# EAGLE design regulator (EAGLE 9.6.2)
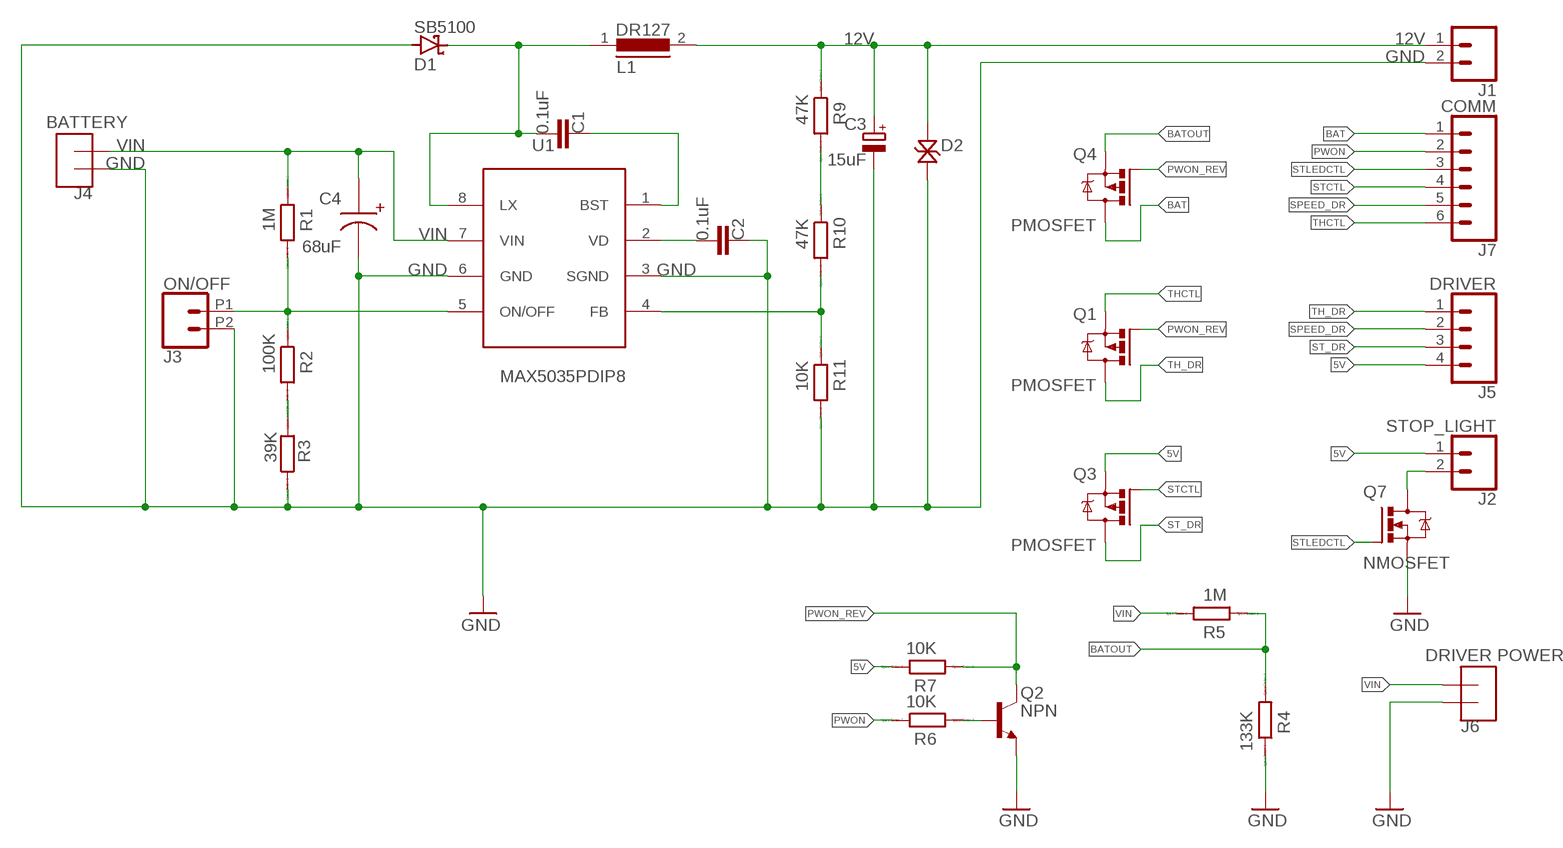
[diagram p0: schematic, sheet 1]

## Parts
C1  0.1uF  C_CHIP-1206(3216-METRIC)  [CAPC3216X135]
C2  0.1uF  C_CHIP-1206(3216-METRIC)  [CAPC3216X135]
C3  15uF  C-POL_TANTALUM-2917(7343-METRIC)  [CAPMP7343X310N]
C4  68uF  CPANASONIC_H13  [CAPAE1230X1250N]
D1  SB5100  MBR360G  [DO201AD]
D2  P4SMAJ12CA  TVS_DIODESMA  [DIOM5027X220N]
J1  CONN_02PTH3  [1X02_LONGPADS]
J2  STOP_LIGHT  CONN_02  [1X02]
J3  ON/OFF  CONN_022.54MM_SCREWTERM  [1X02_2.54_SCREWTERM]
J4  BATTERY  XT60  [XT60]
J5  DRIVER  CONN_04  [1X04]
J6  DRIVER POWER  XT60  [XT60]
J7  COMM  CONN_06LONGPADS  [1X06_LONGPADS]
L1  DR127  [DR127]
Q1  PMOSFET  PMOSFET_SOT23  [SOT23]
Q2  NPN  NPN_SOT23  [SOT95P237X112-3N]
Q3  PMOSFET  PMOSFET_SOT23  [SOT23]
Q4  PMOSFET  PMOSFET_SOT23  [SOT23]
Q7  NMOSFET  NMOSFETSOT23  [SOT23]
R1  1M  RR1206  [R1206]
R2  100K  RR1206  [R1206]
R3  39K  RR1206  [R1206]
R4  133K  RR1206  [R1206]
R5  1M  RR1206  [R1206]
R6  10K  RR1206  [R1206]
R7  10K  RR1206  [R1206]
R9  47K  RR1206  [R1206]
R10  47K  RR1206  [R1206]
R11  10K  RR1206  [R1206]
U1  MAX5035PDIP8  [DIP826W56P254L937H458Q8B]

## Nets
5V: J2.1 J5.4 Q3.2(S) R7.1
12V: C3.1(+) D2.1 J1.1 L1.2 R9.1
BAT: J7.1 Q4.3(D)
BATOUT: Q4.2(S) R4.2 R5.1
GND: C2.1 C3.2(-) C4.2 D1.A D2.2 J1.2 J3.P2 J4.GND J6.GND Q2.1(E) Q7.2(S) R3.1 R4.1 R11.2 U1.3(SGND) U1.6(GND)
N$1: C1.1 U1.1(BST)
N$2: C1.2 D1.C L1.1 U1.8(LX)
N$3: Q2.2(B) R6.2
N$4: C2.2 U1.2(VD)
N$5: J3.P1 R1.2 R2.1 U1.5(ON/OFF)
N$6: R9.2 R10.1
N$7: R2.2 R3.2
N$9: R10.2 R11.1 U1.4(FB)
PWON: J7.2 R6.1
PWON_REV: Q1.1(G) Q2.3(C) Q4.1(G) R7.2
SPEED_DR: J5.2 J7.5
ST_DR: J5.3 Q3.3(D)
STCTL: J7.4 Q3.1(G)
STLEDCTL: J7.3 Q7.1(G)
STLEDOUT: J2.2 Q7.3(D)
TH_DR: J5.1 Q1.3(D)
THCTL: J7.6 Q1.2(S)
VIN: C4.1 J4.VCC J6.VCC R1.1 R5.2 U1.7(VIN)

## Library data of the parts
C1 C2 = Capacitor:C: Capacitor - Generic; CATEGORY: Capacitor
C3 = Capacitor:C-POL: Capacitor Polarised - Generic; CATEGORY: Capacitor
C4 = eScooter:C
D1 = Diodes:MBR360G: DIODE SCHOTTKY 60V 3A DO201AD Manufacturer's datasheet <https://www.onsemi.com/pub/Collateral/MBR350-D.PDF>; CREATED_BY: PCBLayout.com; DIGIKEY_PART_NUMBER: MBR360GOS-ND; MANUFACTURER: ON Semiconductor; MPN: MBR360G; PACKAGE: DO-201AD
D2 = eScooter:TVS_DIODE: TVS protective diode
J1-J3 = SparkFun-Connectors:CONN_02: Multi connection point. Often used as Generic Header-pin footprint for 0.1 inch spaced/style header connections On any of the 0.1 inch spaced packages, you can populate with these: Break Away Headers - Straight <https://www.sparkfun.com/products/116> (PRT-00116) Break Away Male Headers - Right Angle <https://www.sparkfun.com/products/553> (PRT-00553) Female Headers <https://www.sparkfun.com/products/115> (PRT-00115) Break Away Headers - Machine Pin <https://www.sparkfun.com/products/117> (PRT-00117) Break Away Female Headers - Swiss Machine Pin <https://www.sparkfun.com/products/743> (PRT-00743) For SCREWTERMINALS and SPRING TERMINALS visit here: Screw Terimnals on SparkFun.com <https://www.sparkfun.com/search/results?term=Screw+Terminals> (5mm/3.5mm/2.54mm spacing) This device is also useful as a general connection point to wire up your design to another part of your project. Our various solder wires solder well into these plated through hole pads. Hook-Up Wire - Assortment (Stranded, 22 AWG) <https://www.sparkfun.com/products/11375> (PRT-11375) Hook-Up Wire - Assortment (Solid Core, 22 AWG) <https://www.sparkfun.com/products/11367> (PRT-11367) View the entire wire category on our website here <https://www.sparkfun.com/categories/141> Special notes: Molex polarized connector foot print use with: PRT-08233 with associated crimp pins and housings. 2.54_SCREWTERM for use with PRT-10571. 3.5mm Screw Terminal footprints for PRT-08084 5mm Screw Terminal footprints for use with PRT-08432
J4 J6 = eScooter:XT60
J5 = SparkFun-Connectors:CONN_04: Multi connection point. Often used as Generic Header-pin footprint for 0.1 inch spaced/style header connections On any of the 0.1 inch spaced packages, you can populate with these: Break Away Headers - Straight <https://www.sparkfun.com/products/116> (PRT-00116) Break Away Male Headers - Right Angle <https://www.sparkfun.com/products/553> (PRT-00553) Female Headers <https://www.sparkfun.com/products/115> (PRT-00115) Break Away Headers - Machine Pin <https://www.sparkfun.com/products/117> (PRT-00117) Break Away Female Headers - Swiss Machine Pin <https://www.sparkfun.com/products/743> (PRT-00743) For SCREWTERMINALS and SPRING TERMINALS visit here: Screw Terimnals on SparkFun.com <https://www.sparkfun.com/search/results?term=Screw+Terminals> (5mm/3.5mm/2.54mm spacing) This device is also useful as a general connection point to wire up your design to another part of your project. Our various solder wires solder well into these plated through hole pads. Hook-Up Wire - Assortment (Stranded, 22 AWG) <https://www.sparkfun.com/products/11375> (PRT-11375) Hook-Up Wire - Assortment (Solid Core, 22 AWG) <https://www.sparkfun.com/products/11367> (PRT-11367) View the entire wire category on our website here <https://www.sparkfun.com/categories/141> Special notes: Molex polarized connector foot print use with SKU : PRT-08231 with associated crimp pins and housings. 1MM SMD Version SKU: PRT-10208; PROD_ID: CONN-09696
J7 = SparkFun-Connectors:CONN_06: Multi connection point. Often used as Generic Header-pin footprint for 0.1 inch spaced/style header connections On any of the 0.1 inch spaced packages, you can populate with these: Break Away Headers - Straight <https://www.sparkfun.com/products/116> (PRT-00116) Break Away Male Headers - Right Angle <https://www.sparkfun.com/products/553> (PRT-00553) Female Headers <https://www.sparkfun.com/products/115> (PRT-00115) Break Away Headers - Machine Pin <https://www.sparkfun.com/products/117> (PRT-00117) Break Away Female Headers - Swiss Machine Pin <https://www.sparkfun.com/products/743> (PRT-00743) Arduino Stackable Header - 6 Pin <https://www.sparkfun.com/products/9280> (PRT-09280) For SCREWTERMINALS and SPRING TERMINALS visit here: Screw Terimnals on SparkFun.com <https://www.sparkfun.com/search/results?term=Screw+Terminals> (5mm/3.5mm/2.54mm spacing) This device is also useful as a general connection point to wire up your design to another part of your project. Our various solder wires solder well into these plated through hole pads. Hook-Up Wire - Assortment (Stranded, 22 AWG) <https://www.sparkfun.com/products/11375> (PRT-11375) Hook-Up Wire - Assortment (Solid Core, 22 AWG) <https://www.sparkfun.com/products/11367> (PRT-11367) View the entire wire category on our website here <https://www.sparkfun.com/categories/141>
L1 = inductors:DR127: High Power Density, High Efficiency, Shielded Inductors Source: coiltronics_dr_series.pdf; SPICEPREFIX: L
Q1 Q3 Q4 = Transistor:PMOSFET: P-Channel MOSFET - Generic; CATEGORY: Transistor; SUB-CATEGORY: MOSFET; TYPE: P-Channel
Q2 = Transistor:NPN: NPN - Generic; CATEGORY: Transistor; SUB-CATEGORY: BJT; TYPE: NPN
Q7 = Transistor:NMOSFET: N-Channel MOSFET - Generic; CATEGORY: Transistor; SUB-CATEGORY: MOSFET; TYPE: N-Channel
R1-R7 R9-R11 = eagle-ltspice:R: RESISTOR, European symbol; SPICEMODEL: NONE; SPICEPREFIX: R
U1 = eScooter:MAX5035: The MAX5035 easy-to-use, high-efficiency, high-volt-age, step-down DC-DC converter operates from aninput voltage up to 76V and consumes only 270μA qui-escent current at no load.

## Board
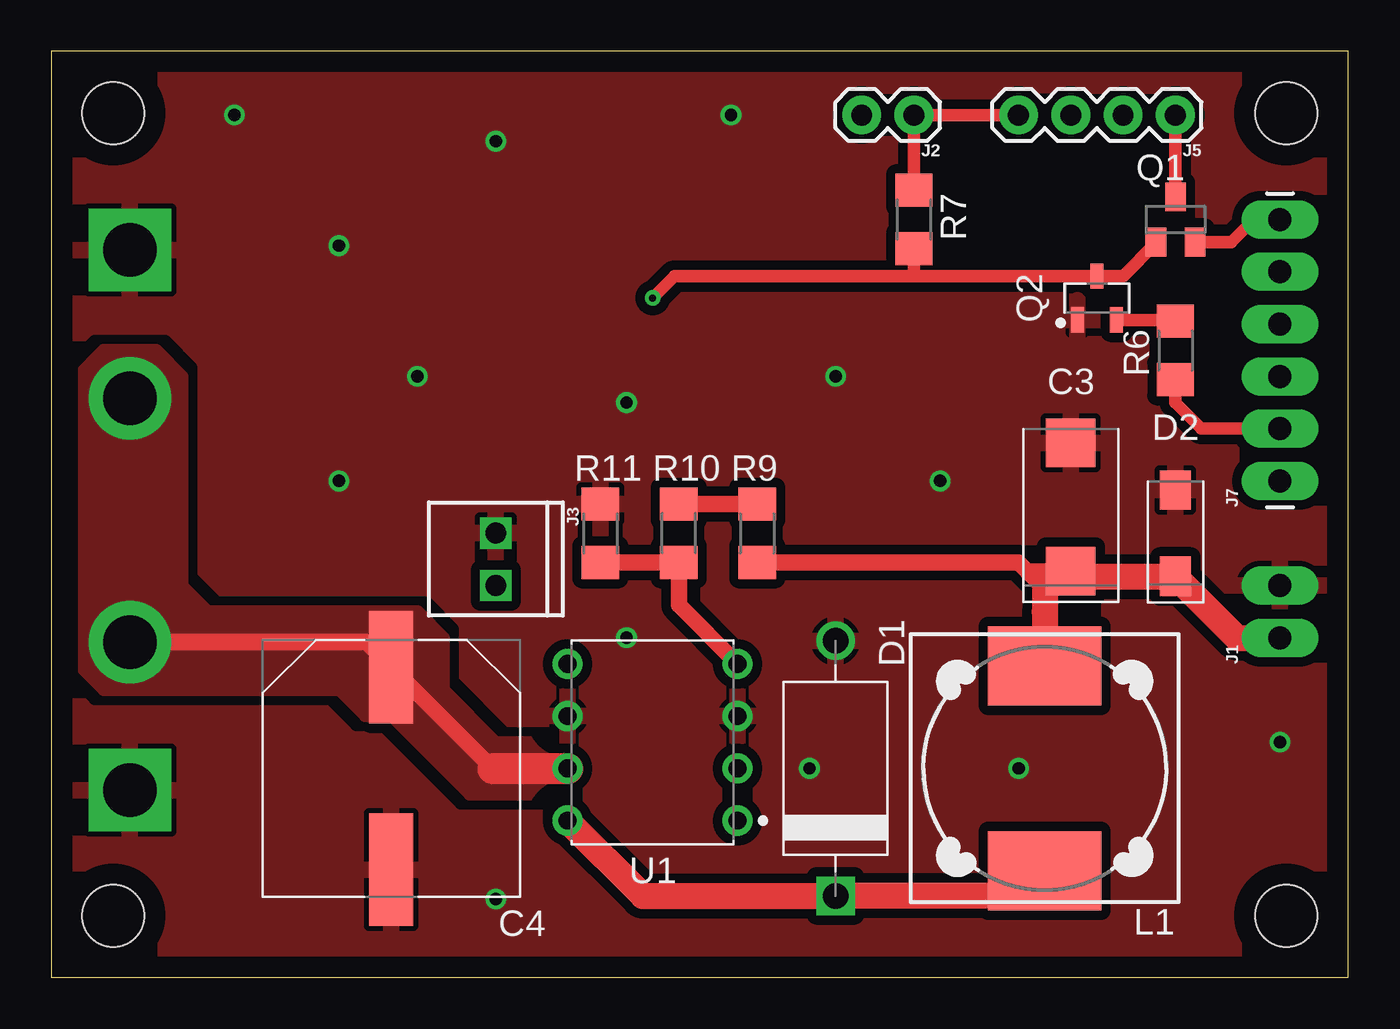
[diagram p1: board, top side]
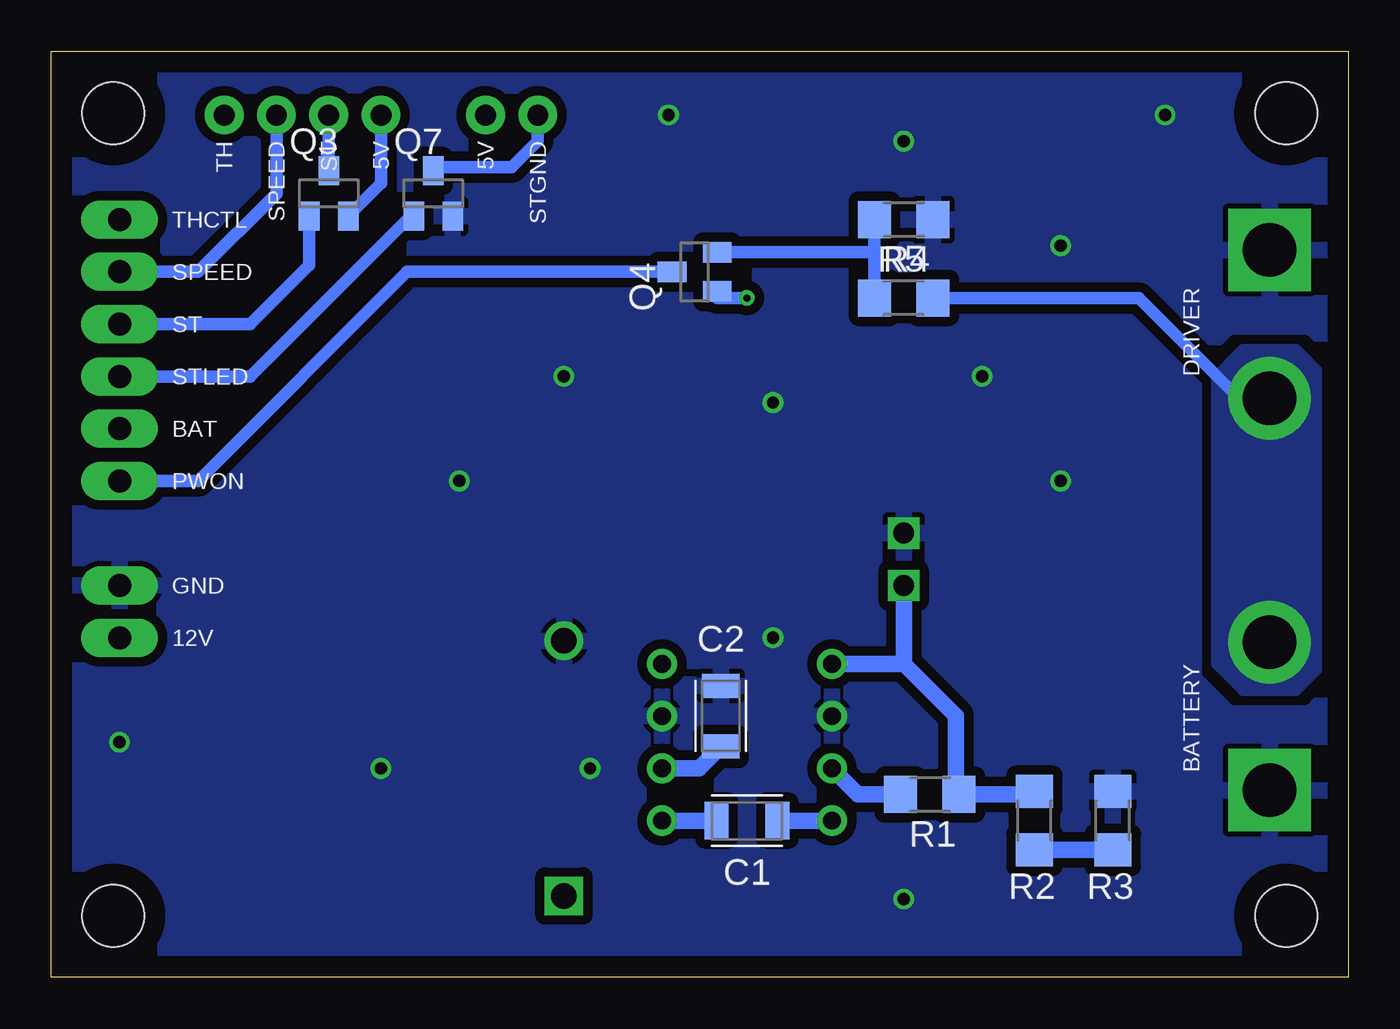
[diagram p2: board, bottom side, seen from below]

Size 63 x 45 mm. Coordinates in mm from the lower left corner, seen from the top.
Outline: 0,0 63,0 63,45 0,45 0,0
Copper layers (1*16): Top 0.035mm / dielectric 1.5mm / Bottom 0.035mm
Design rules "default *": minimum track width 6mil, minimum drill 0.35mm, track to track 18mil, track to pad 18mil, pad to pad 18mil, via to via 18mil, smd to smd 6mil, copper to edge 40mil, drill to drill 6mil, minimum pad ring 10mil, minimum via ring 8mil, stop-mask expansion 4mil, vias tented up to drill 0mil, thermal gap 10mil
Holes 3 mm at 3,42 3,3 60,3 60,42

### Footprints (pad centres in the part's own frame; a part is rotated, then mirrored left to right if it is on the bottom)
CAPC3216X135 = smd 1.165 x 1.815: 1 -1.475,0; 2 1.475,0
CAPMP7343X310N = smd 2.368 x 2.404: 1 -3.121,0; 2 3.121,0
CAPAE1230X1250N = smd 5.462 x 2.129: 1 -4.925,0; 2 4.925,0
DO201AD = drill 1.25: A 6.2,0 | drill 1.25 square: C -6.2,0
DIOM5027X220N = smd 1.912 x 1.512: 1 -2.1,0; 2 2.1,0
1X02_LONGPADS = drill 1.118 pad 1.88 long: 1 0,0; 2 2.54,0
1X02 = drill 1.016 pad 1.88: 1 0,0; 2 2.54,0
1X02_2.54_SCREWTERM = drill 1.016 square: P1 2.54,0; P2 0,0
XT60 = drill 2.6 pad 4 square: GND -3.6,0 | drill 2.6 pad 4: VCC 3.6,0
1X04 = drill 1.016 pad 1.88: 1 0,0; 2 2.54,0; 3 5.08,0; 4 7.62,0
1X06_LONGPADS = drill 1.118 pad 1.88 long: 1 0,0; 2 2.54,0; 3 5.08,0; 4 7.62,0; 5 10.16,0; 6 12.7,0
DR127 = smd 3.85 x 5.5: 1 -4.975,0; 2 4.975,0
SOT23 = smd 1 x 1.4: 1 -0.95,-1.1; 2 0.95,-1.1; 3 0,1.1
SOT95P237X112-3N = smd 1.224 x 0.625: 1 -1.064,0.95; 2 -1.064,-0.95; 3 1.064,0
R1206 = smd 1.6 x 1.803: 1 -1.422,0; 2 1.422,0
DIP826W56P254L937H458Q8B = drill 0.866 pad 1.466: 1 -4.13,3.81; 2 -4.13,1.27; 3 -4.13,-1.27; 4 -4.13,-3.81; 5 4.13,-3.81; 6 4.13,-1.27; 7 4.13,1.27; 8 4.13,3.81

### Placement (x,y rotation side)
C1  29.21,7.62 0 bottom
C2  30.48,12.7 270 bottom
C3  49.53,22.86 90 top
C4  16.51,10.16 270 top
D1  38.1,10.16 90 top
D2  54.61,21.59 90 top
J1  59.69,16.51 90 top
J2  41.91,41.91 180 top
J3  21.59,21.59 270 top
J4  3.81,12.7 90 top
J5  54.61,41.91 180 top
J6  3.81,31.75 270 top
J7  59.69,24.13 90 top
L1  48.26,10.16 90 top
Q1  54.61,36.83 0 top
Q2  50.8,33.02 90 top
Q3  49.53,38.1 0 bottom
Q4  31.75,34.29 90 bottom
Q7  44.45,38.1 0 bottom
R1  20.32,8.89 0 bottom
R2  15.24,7.62 270 bottom
R3  11.43,7.62 270 bottom
R4  21.59,36.83 180 bottom
R5  21.59,33.02 0 bottom
R6  54.61,30.48 90 top
R7  41.91,36.83 270 top
R9  34.29,21.59 90 top
R10  30.48,21.59 270 top
R11  26.67,21.59 90 top
U1  29.21,11.43 180 top

### Tracks (layer width: path | path; a pad name or v marks a point on that pad's centre or on a via)
5V
  Top 0.61: R7.1 J2.1 J5.4
  Bottom 0.61: Q3.2 46.99,38.59 J5.4
12V
  Top 0.813: R9.1 46.99,20.17 47.42,19.74 | C3.1 47.42,19.74 | 47.42,19.74 48.18,18.97 48.77,18.97 C3.1 | C3.1 48.26,18.47 48.26,17.78
  Top 1.27: 48.26,19.05 48.26,17.78 L1.2 | C3.1 49.78,19.49 D2.1 57.59,16.51 J1.1
BAT
  Bottom 0.61: Q4.3 45.72,34.29 55.88,24.13 J7.1
BATOUT
  Bottom 0.61: R4.2 23.01,35.24 | 23.01,35.24 R5.1 | 23.01,35.24 Q4.2
GND  (via drill 0.6)
  other vias: 13.97,24.13 8.89,41.91 21.59,40.64 13.97,35.56 17.78,29.21 33.02,41.91 27.94,27.94 38.1,29.21 43.18,24.13 36.83,10.16 46.99,10.16 59.69,11.43 21.59,3.81 27.94,16.51
  pour Top (rank 6): 0,45 0,0 63,0 63,45
  pour Bottom (rank 6): 0,45 0,0 63,0 63,45
N$1
  Bottom 0.813: U1.1 C1.1
N$2
  Top 1.27: U1.8 28.74,3.96 D1.C 47.03,3.96 L1.1
  Bottom 0.813: C1.2 U1.8
N$3
  Top 0.61: Q2.2 54.56,31.96 R6.2
N$4
  Bottom 0.813: C2.2 31.55,10.16 U1.2
N$5
  Bottom 0.813: 21.59,15.24 19.05,12.7 19.05,9.04 R1.2 15.24,8.89 R2.1 | 21.59,15.24 J3.P1 | 21.59,15.24 U1.5
N$6
  Top 0.813: R9.2 R10.1
N$7
  Bottom 0.813: R2.2 R3.2
N$9
  Top 0.813: R10.2 R11.1 | R10.2 30.48,20.32 | R10.2 30.48,18.1 U1.4
PWON
  Top 0.61: J7.2 55.88,26.67 54.61,27.94 R6.1
PWON_REV  (via drill 0.35)
  Top 0.61: Q1.1 53.66,35.67 52.07,34.08 Q2.3 41.91,34.08 | 41.91,34.08 30.27,34.08 v29.21,33.02 | R7.2 41.91,34.08
  Bottom 0.61: v29.21,33.02 30.65,33.02 Q4.1
SPEED_DR
  Top 0.813: 58.42,34.29 J7.5
  Bottom 0.61: J5.2 52.07,38.1 55.88,34.29 J7.5
ST_DR
  Bottom 0.61: Q3.3 J5.3
STCTL
  Bottom 0.61: Q3.1 50.48,34.61 53.34,31.75 J7.4
STLEDCTL
  Bottom 0.61: J7.3 53.34,29.21 45.55,37 Q7.1
STLEDOUT
  Bottom 0.61: J2.2 39.37,40.64 40.64,39.37 44.28,39.37 Q7.3
TH_DR
  Top 0.61: Q1.3 J5.1
THCTL
  Top 0.61: Q1.2 57.32,35.73 58.42,36.83 J7.6
VIN
  Top 0.813: 21.43,10.16 C4.1 15.29,16.3 J4.VCC
  Top 1.5: 21.43,10.16 U1.7
  Bottom 0.61: J6.VCC 4.02,27.94 5.08,27.94 10.16,33.02 R5.2
  Bottom 0.813: R1.1 23.81,8.89 U1.7
  pour Bottom (isolate 1.27, rank 2, no thermals): 1.27,15.24 1.27,29.21 2.54,30.48 5.08,30.48 6.35,29.21 6.35,15.24 5.08,13.97 2.54,13.97
  pour Top (isolate 1.27, no thermals): 1.27,29.21 1.27,15.24 2.54,13.97 13.97,13.97 15.24,12.7 16.51,12.7 20.32,8.89 24.13,8.89 25.4,10.16 24.13,11.43 21.59,11.43 19.05,13.97 19.05,16.51 17.78,17.78 7.62,17.78 6.35,19.05 6.35,29.21 5.08,30.48 2.54,30.48

### Text on the board
bNames: STGND | 5V | 5V | ST | SPEED | TH | THCTL | SPEED | ST | DRIVER | STLED | BAT | PWON | GND | 12V | BATTERY